# Altium schematic sheet STM32.SchDoc
size A3; SheetNumber: 2; SheetTotal: 3
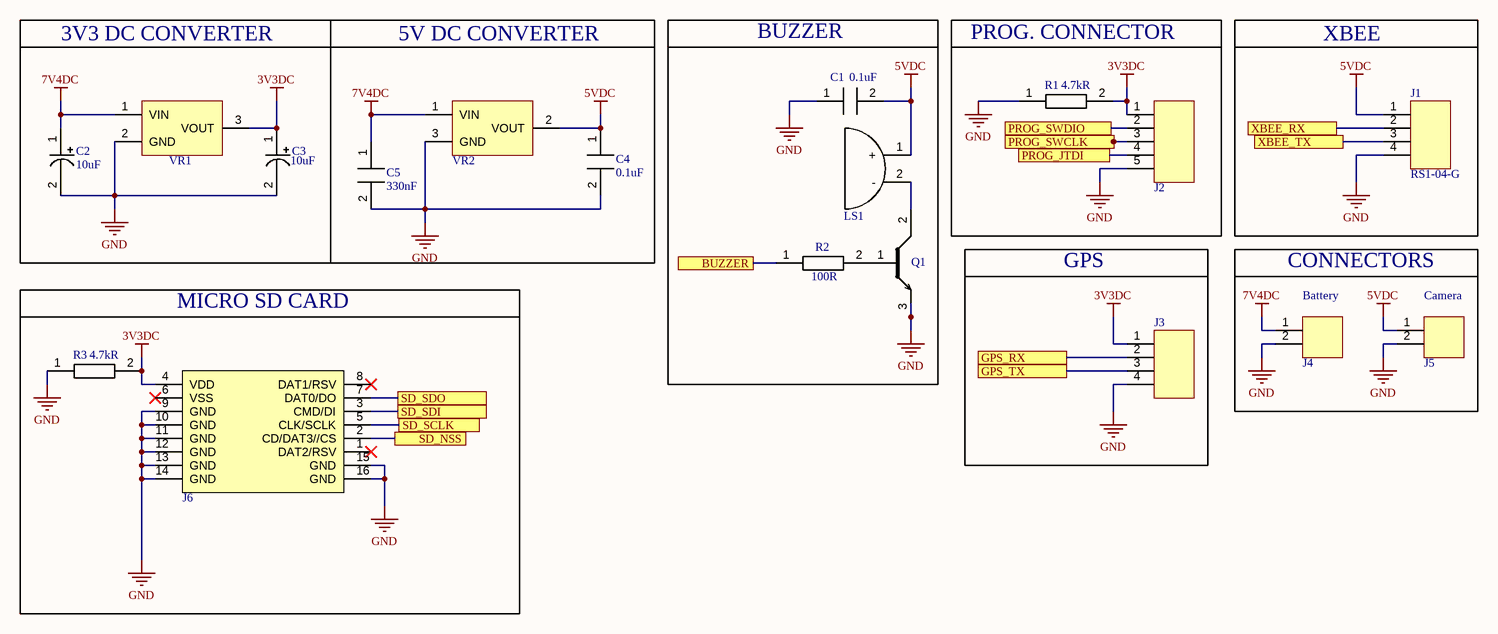
[diagram p0: STM32.SchDoc]

## Parts
C1  value 0.1uF  [CAP_1206]  (hidden comment: C1206C104K3RAC7800)
C2  value 10uF  [CAP_1206_TANT]  (hidden comment: T494A106M020AT)
C3  value 10uF  [CAP_1206_TANT]  (hidden comment: T494A106M020AT)
C4  value 0.1uF  [CAP_1206]  (hidden comment: C1206C104K3RAC7800)
C5  value 330nF  [CAP_1206]  (hidden comment: C1206C104K3RAC7800)
J1  RS1-04-G  [PINHEADER_1X4_TH]
J2  SMH-105-02-L-S  [PINHEADER1X5_RA]  (value not drawn)
J3  RS1-04-G  [PINHEADER_1X4_TH]  (value not drawn)
J4  0393570002  [2P_FEMALE_3.5MM_CONN]  (value not drawn)
J5  0393570002  [2P_FEMALE_3.5MM_CONN]  (value not drawn)
J6  2201778-1  [MICRO_SD]  (value not drawn)
LS1  CMI-9605-0580T  [CMI-9605]  (value not drawn)
Q1  MMBT3904-7-F  [SOT_23_3]  (value not drawn)
R1  value 4.7kR  [RE_1206]  (hidden comment: RC1206FR-074K7L)
R2  value 100R  [RE_0603]  (hidden comment: RC0603JR-07100RL)
R3  value 4.7kR  [RE_1206]  (hidden comment: RC1206FR-074K7L)
VR1  LD1117V33  [DPAK_TO-252-3]  (value not drawn)
VR2  L7805CDT-TR  [DPAK_TO-252-3]  (value not drawn)

## Blocks framed on the sheet
3V3 DC CONVERTER: C2 C3 VR1
BUZZER: C1 LS1 Q1 R2
PROG. CONNECTOR: J2 R1
XBEE: J1
CONNECTORS: J4 J5
GPS: J3

## Ports
BUZZER (see MCUs_STM32[4B]), GPS_RX (see MCUs_STM32[6B]), GPS_TX (see MCUs_STM32[6B]), PROG_JTDI (see MCUs_STM32[6B]), PROG_SWCLK (see MCUs_STM32[6B]), PROG_SWDIO (see MCUs_STM32[6B]), SD_NSS (see MCUs_STM32[4B]), SD_SCLK (see MCUs_STM32[4B]), SD_SDI (see MCUs_STM32[4C]), SD_SDO (see MCUs_STM32[4C]), XBEE_RX (see MCUs_STM32[6B]), XBEE_TX (see MCUs_STM32[6B])

## Nets
3V3DC: C3.1 J2.1 J3.1 J6.4(VDD) R1.2 R3.2 VR1.3(VOUT)
5VDC: C1.2 C4.1 J1.1 J5.1 LS1.1(+) VR2.2(VOUT)
7V4DC: C2.1 C5.1 J4.1 VR1.1(VIN) VR2.1(VIN)
GND: C1.1 C2.2 C3.2 C4.2 C5.2 J1.4 J2.5 J3.4 J4.2 J5.2 J6.9(GND) J6.10(GND) J6.11(GND) J6.12(GND) J6.13(GND) J6.14(GND) J6.15(GND) J6.16(GND) Q1.3 R1.1 R3.1 VR1.2(GND) VR2.3(GND)
BUZZER: R2.1 ; port BUZZER
GPS_RX: J3.2 ; port GPS_RX
GPS_TX: J3.3 ; port GPS_TX
PROG_JTDI: J2.4 ; port PROG_JTDI
PROG_SWCLK: J2.3 ; port PROG_SWCLK
PROG_SWDIO: J2.2 ; port PROG_SWDIO
SD_NSS: J6.2(CD/DAT3//CS) ; port SD_NSS
SD_SCLK: J6.5(CLK/SCLK) ; port SD_SCLK
SD_SDI: J6.3(CMD/DI) ; port SD_SDI
SD_SDO: J6.7(DAT0/DO) ; port SD_SDO
XBEE_RX: J1.2 ; port XBEE_RX
XBEE_TX: J1.3 ; port XBEE_TX
NetLS1_2: LS1.2(-) Q1.2
NetQ1_1: Q1.1 R2.2

Not connected (* = marked no-connect by the designer): J6 1(DAT2/RSV)* 6(VSS)* 8(DAT1/RSV)*

## Notes on the sheet
- 5V DC CONVERTER
- MICRO SD CARD
- (near J4) Battery
- (near J5) Camera
- Document Name
- Prepared By
- Company Name
- Checked By
- A. Can KARACAN
- Release Date
- Department
- R&D- Hardware
- Size
- Change Date
- A3
- Approved By
- Sheet
- /

## Library data of the parts
C1 C4 = CAP CER 0.1uF 1206: Multilayer Ceramic Capacitor, 0.1 uF, 25 V, ± 10%, X7R, 1206 [3216 Metric]; Manufacturer: KEMET; Manufacturer Part Number: C1206C104K3RACTU; Material: 4241ConductorMaterial; Voltage Rating: 25V; Dissipation Factor: 3.5%; Designed By: Ahmet Can; Supplier: Digi-Key; Supplier Part Number: 399-C1206C104K3RAC7800CT-ND; RoHS: Yes; Category: Ceramic Capacitors; Stock: 306395; Pricing: 1=0,1, 10=0,072, 50=0,0408, 100=0,0338, 500=0,02372, 1000=0,01963 (USD); Mounting Technology: Surface Mount; Case/Package: 1206; Case Code (Metric): 3216; Case Code (Imperial): 1206; Dielectric Material: Ceramic; Min Operating Temperature: -55°C; Max Operating Temperature: 125°C; Tolerance: 10%; Dielectric: X7R; Packaging: Cut Tape; Package Quantity: 4000; Voltage Rating (DC): 25V; Termination: SMD/SMT; Series: C; Construction: Flat; Length: 3.2mm; Width: 0.063inch; Height: 0.78mm; Depth: 1.6mm; Thickness: 0.035inch; Reach SVHC Compliant: No; RoHS Compliant: Yes; ComponentLink1URL: https://datasheet.ciiva.com/5416/kem-c1002-x7r-smd-5416282.pdf?src-supplier=Mouser; ComponentLink1Description: https://datasheet.ciiva.com/5416/kem-c1002-x7r-smd-5416282.pdf?src-supplier=Mouser
C2 C3 = CAP TAN 10uF 2306: Cap Tant Solid 10uF 20V A CASE 20% (3.2 X 1.6 X 1.6mm) SMD 3216-18 3 Ohm 125 C T/R; Manufacturer: KEMET; Supplier: Digi-Key; Supplier Part Number: 399-5157-1-ND; Manufacturer Part Number: T494A106M020AT; RoHS: Yes; Category: Tantalum Capacitors; Stock: 64164; Pricing: 1=0,78, 10=0,596, 50=0,495, 100=0,4262, 500=0,32996, 1000=0,28414 (USD); ComponentLink1URL: https://datasheet.ciiva.com/22691/1778347-22691442.pdf?src-supplier=Element14; ComponentLink1Description: https://datasheet.ciiva.com/22691/1778347-22691442.pdf?src-supplier=Element14; ComponentLink2URL: https://datasheet.ciiva.com/258/kem-t2008-t494-258774.pdf?src-supplier=Digi-Key; ComponentLink2Description: https://datasheet.ciiva.com/258/kem-t2008-t494-258774.pdf?src-supplier=Digi-Key; ComponentLink3URL: https://datasheet.ciiva.com/258/kem-t2008-t494-258775.pdf?src-supplier=Digi-Key; ComponentLink3Description: https://datasheet.ciiva.com/258/kem-t2008-t494-258775.pdf?src-supplier=Digi-Key; ComponentLink4URL: https://datasheet.ciiva.com/258/kem-t2008-t494-258776.pdf?src-supplier=Digi-Key; ComponentLink4Description: https://datasheet.ciiva.com/258/kem-t2008-t494-258776.pdf?src-supplier=Digi-Key
C5 = CAP CER 330nF 1206: Cap Ceramic 0.33uF 16V X7R 10% SMD 1206 125°C Plastic T/R; Manufacturer: KEMET; Manufacturer Part Number: C1206C334K4RAC7800; Designed By: Ahmet Can; Supplier: Digi-Key; Supplier Part Number: 399-C1206C334K4RAC7800CT-ND; RoHS: Yes; Category: Ceramic Capacitors; Stock: 6810; Pricing: 1=0,21, 10=0,144, 50=0,096, 100=0,0816, 500=0,0576, 1000=0,0504 (USD); Mounting Technology: Surface Mount; Case/Package: 1206; Dielectric Material: Ceramic; Min Operating Temperature: -55°C; Max Operating Temperature: 125°C; Tolerance: 10%; Dielectric: X7R; Packaging: Tape and Reel; Voltage Rating (DC): 16V; Construction: Flat; Length: 3.2mm; Height: 0.78mm; Depth: 1.6mm; Radiation Hardening: No; RoHS Compliant: Yes; ComponentLink1URL: http://www.kemet.com/kemet/web/homepage/kechome.nsf/weben/C4DA2DA1D1C9D3C3CA2570A50016092D/$file/KEM_C1002_X7R_SMD.pdf; ComponentLink1Description: http://www.kemet.com/kemet/web/homepage/kechome.nsf/weben/C4DA2DA1D1C9D3C3CA2570A50016092D/$file/KEM_C1002_X7R_SMD.pdf
J1 J3 = J_RS1-04-G: 4 Position Receptacle Connector 0.100" (2.54mm) Through Hole Gold; Manufacturer: Adam Equipment; Supplier: Digi-Key; Supplier Part Number: 2057-RS1-04-G-ND; Manufacturer Part Number: RS1-04-G; RoHS: No; Category: Headers and Wire Housings; Stock: 4500; Pricing: 1=0,31, 10=0,267, 80=0,20788, 800=0,15695, 1600=0,14084, 5600=0,12726, 10400=0,11878 (USD); ComponentLink1URL: https://datasheet.ciiva.com/19462/2169758-19462353.pdf?src-supplier=Jameco; ComponentLink1Description: https://datasheet.ciiva.com/19462/2169758-19462353.pdf?src-supplier=Jameco
J2 = J_SMH-105-02-L-S: 5 Position Receptacle Connector 0.100" (2.54mm) Surface Mount, Right Angle Gold; Manufacturer: Samtec; Number of Contacts: 5; Designed By: Ahmet Can; Supplier: Digi-Key; Supplier Part Number: SAM11813-ND; Manufacturer Part Number: SMH-105-02-L-S; RoHS: Yes; Category: Connectors; Stock: 47; Pricing: 1=2,18, 10=1,899, 100=1,6968, 500=1,414, 1000=1,212, 5000=1,07464 (USD); Contact Plating: Gold; Contact Material: Bronze; Contact Finish - Mating: GOLD; Insulation Color: Black; Insulation Material: Polymer; Contact Shape: Square; Min Operating Temperature: -55°C; Max Operating Temperature: 125°C; Packaging: Rail/Tube; Number of Rows: 1; Termination: Solder; Gender: Receptacle; Orientation: Horizontal; Connector Type: Receptacle; Fastening Type: Pull; Series: SMH; Contact Type: Forked; Number of Positions: 5; Pitch: 2.54mm; Radiation Hardening: No; RoHS Compliant: Yes; Reach SVHC Compliant: No; Flammability Rating: UL94 V-0; ComponentLink1URL: http://www.farnell.com/datasheets/1927708.pdf?_ga=2.237598468.569325269.1503285096-1413671594.1503025027&src-supplier=Farnell; ComponentLink1Description: http://www.farnell.com/datasheets/1927708.pdf?_ga=2.237598468.569325269.1503285096-1413671594.1503025027&src-supplier=Farnell; ComponentLink2URL: http://www.samtec.com/documents/webfiles/pdf/SMH.PDF?src-supplier=Newark; ComponentLink2Description: http://www.samtec.com/documents/webfiles/pdf/SMH.PDF?src-supplier=Newark; ComponentLink3URL: http://www.samtec.com/documents/webfiles/pdf/SMH.PDF?src-supplier=Avnet; ComponentLink3Description: http://www.samtec.com/documents/webfiles/pdf/SMH.PDF?src-supplier=Avnet; ComponentLink4URL: http://suddendocs.samtec.com/catalog_english/smh.pdf?src-supplier=Digi-Key; ComponentLink4Description: http://suddendocs.samtec.com/catalog_english/smh.pdf?src-supplier=Digi-Key
J4 J5 = J_2P_FML_3.5MM: 3.50mm Pitch Beau Eurostyle Fixed Mount PCB Terminal Block, 2 Circuits; Manufacturer: Molex; Supplier: Digi-Key; Supplier Part Number: WM7877-ND; Manufacturer Part Number: 0393570002; RoHS: Yes; Stock: 107955; Pricing: 1=1,04, 10=0,729, 25=0,6804, 50=0,6174, 100=0,6147, 250=0,51908, 500=0,49176, 1000=0,43713, 5000=0,35517 (USD); ComponentLink1URL: https://datasheet.ciiva.com/6751/393590004-sd-6751377.pdf?src-supplier=Digi-Key; ComponentLink1Description: https://datasheet.ciiva.com/6751/393590004-sd-6751377.pdf?src-supplier=Digi-Key
J6 = J_2201778-1: Conn Memory Card RCP 8 POS 1.1mm Solder RA SMD 0.5A/Contact T/R; Manufacturer: TE Connectivity; Underplate Material: Nickel; Number of Positions: 8; Shielding: Unshielded; Contact Current Rating: 500mA; Circuit Application: Signal; Pitch: 0.04inch; Designed By: Ahmet Can; Supplier: Digi-Key; Supplier Part Number: A118117CT-ND; Manufacturer Part Number: 2201778-1; RoHS: Yes; Category: Memory Connectors; Stock: 6669; Pricing: 1=2,81, 10=2,503, 25=2,49, 50=2,4646, 100=2,2614, 250=2,24864, 500=2,04538 (USD); Mounting Technology: Surface Mount; Contact Material: Copper Alloy; Contact Plating: Gold; Housing Color: Black; Color: Black; Housing Material: Polymer; Shell Material: Copper Alloy; Min Operating Temperature: -30°C; Max Operating Temperature: 85°C; Packaging: Tape and Reel; Number of Rows: 1; Series: -; Termination: SMD/SMT; Flammability Rating: UL94 V-0; RoHS Compliant: Yes; Lead Free: Lead Free; ELV: Compliant; Reach SVHC Compliant: Unknown; ComponentLink1URL: https://datasheet.ciiva.com/23834/1737844-23834387.pdf?src-supplier=Newark; ComponentLink1Description: https://datasheet.ciiva.com/23834/1737844-23834387.pdf?src-supplier=Newark; ComponentLink2URL: https://datasheet.ciiva.com/22783/600547-22783409.pdf?src-supplier=Farnell; ComponentLink2Description: https://datasheet.ciiva.com/22783/600547-22783409.pdf?src-supplier=Farnell; ComponentLink3URL: https://datasheet.ciiva.com/22796/1651579-22796241.pdf?src-supplier=Farnell; ComponentLink3Description: https://datasheet.ciiva.com/22796/1651579-22796241.pdf?src-supplier=Farnell; ComponentLink4URL: https://datasheet.ciiva.com/29722/eng-cd-2201778-a-29722873.pdf?src-supplier=Digi-Key; ComponentLink4Description: https://datasheet.ciiva.com/29722/eng-cd-2201778-a-29722873.pdf?src-supplier=Digi-Key; ComponentLink5URL: https://datasheet.ciiva.com/22710/600547-22710877.pdf?src-supplier=Element14; ComponentLink5Description: https://datasheet.ciiva.com/22710/600547-22710877.pdf?src-supplier=Element14; ComponentLink6URL: https://datasheet.ciiva.com/22726/600547-22726299.pdf?src-supplier=Element14; ComponentLink6Description: https://datasheet.ciiva.com/22726/600547-22726299.pdf?src-supplier=Element14; ComponentLink7URL: https://datasheet.ciiva.com/29722/eng-cd-2201778-a-29722874.pdf?src-supplier=Digi-Key; ComponentLink7Description: https://datasheet.ciiva.com/29722/eng-cd-2201778-a-29722874.pdf?src-supplier=Digi-Key
LS1 = LS_CMI-9605-0580T: 9.6 mm, 5 Vdc, 80 dB, Through Hole, Driving Circuit, Magnetic Audio Indicator Buzzer; Manufacturer: CUI; Designed By: Ahmet Can; Min Supply Voltage: 3V; Max Supply Voltage: 7V; SPL: 80dB @ 5V, 10cm; Nominal Supply Voltage: 5V; Frequency: 2.7kHz; Supply Current: 30mA; Supplier: Digi-Key; Supplier Part Number: 102-CMI-9605-0580T-ND; Manufacturer Part Number: CMI-9605-0580T; RoHS: No; Max Operating Temperature: 70°C; Min Operating Temperature: -30°C; Mounting Technology: Through Hole; Packaging: Box; Case/Package: CMI-9605; Voltage Rating: 5V
Q1 = Q_MMBT3904-7-F: Transistor General Purpose BJT NPN 40 Volt 0.2A Automotive 3-Pin SOT-23-3; Manufacturer: Diodes Zetex; Max Power Dissipation: 300mW; Collector Emitter Voltage (VCEO): 40V; Max Collector Current: 200mA; Collector Base Voltage (VCBO): 60V; Power Dissipation: 350mW; Frequency: 300MHz; hFE Min: 100; Number of Elements: 1; Emitter Base Voltage (VEBO): 6V; Collector Emitter Saturation Voltage: 300mV; Designed By: Ahmet Can; Supplier: Digi-Key; Supplier Part Number: MMBT3904-FDICT-ND; Manufacturer Part Number: MMBT3904-7-F; RoHS: Yes; Category: BJTs; Stock: 5948624; Pricing: 1=0,12, 10=0,111, 100=0,0607, 500=0,03732, 1000=0,02545 (USD); Mounting Technology: Surface Mount; Case/Package: SOT-23; Pins: 3; Weight: 0.000282oz; Min Operating Temperature: -55°C; Max Operating Temperature: 150°C; Polarity: NPN; Packaging: Tape and Reel; Voltage Rating (DC): 40V; Package Quantity: 3000; Transition Frequency: 300MHz; Collector Emitter Breakdown Voltage: 40V; Max Breakdown Voltage: 40V; Continuous Collector Current: 200mA; Clock Frequency: 300MHz; Gain Bandwidth Product: 300MHz; Series: Automotive, AEC-Q101; Collector-emitter Voltage-Max: 300mV; Length: 3.05mm; Width: 1.4mm; Height: 1mm; Radiation Hardening: No; Reach SVHC Compliant: No; Lead Free: Lead Free; RoHS Compliant: Yes; ComponentLink1URL: https://datasheet.ciiva.com/11201/ds30036-11201778.pdf?src-supplier=Avnet; ComponentLink1Description: https://datasheet.ciiva.com/11201/ds30036-11201778.pdf?src-supplier=Avnet; ComponentLink2URL: https://datasheet.ciiva.com/15138/getdatasheetpartid-53265-15138780.pdf?src-supplier=Verical; ComponentLink2Description: https://datasheet.ciiva.com/15138/getdatasheetpartid-53265-15138780.pdf?src-supplier=Verical; ComponentLink3URL: https://datasheet.ciiva.com/22711/1915516-22711750.pdf?src-supplier=Element14; ComponentLink3Description: https://datasheet.ciiva.com/22711/1915516-22711750.pdf?src-supplier=Element14; ComponentLink4URL: https://datasheet.ciiva.com/11198/ds30036-11198999.pdf?src-supplier=Avnet; ComponentLink4Description: https://datasheet.ciiva.com/11198/ds30036-11198999.pdf?src-supplier=Avnet; ComponentLink5URL: https://datasheet.ciiva.com/6361/ds30036-6361256.pdf?src-supplier=Digi-Key; ComponentLink5Description: https://datasheet.ciiva.com/6361/ds30036-6361256.pdf?src-supplier=Digi-Key; ComponentLink6URL: https://datasheet.ciiva.com/6361/ds30036-6361254.pdf?src-supplier=Digi-Key; ComponentLink6Description: https://datasheet.ciiva.com/6361/ds30036-6361254.pdf?src-supplier=Digi-Key
R1 R3 = RES 4K7 1206: SMD Chip Resistor, 4.7 kOhm, ± 1%, 250 mW, 1206 [3216 Metric], Thick Film, General Purpose; Manufacturer: Yageo; Voltage Rating (DC): 200V; Temperature Coefficient: 100ppm/°C; Power Rating: 250mW; Designed By: Ahmet Can; Supplier: Digi-Key; Supplier Part Number: 311-4.70KFRCT-ND; Manufacturer Part Number: RC1206FR-074K7L; RoHS: Yes; Category: Chip SMD Resistors; Stock: 2180352; Pricing: 1=0,1, 10=0,036, 50=0,0232, 100=0,0195, 500=0,01364, 1000=0,01187 (USD); Case/Package: 1206; Pins: 2; Case Code (Imperial): 1206; Case Code (Metric): 3216; Min Operating Temperature: -55°C; Max Operating Temperature: 155°C; Tolerance: 1%; Packaging: Tape and Reel; Resistor Type: Thick Film; Voltage Rating: 200V; Series: RC02H; Resistance Tolerance: 1%; Width: 1.6mm; Lead Free: Lead Free; Reach SVHC Compliant: Unknown; RoHS Compliant: Yes
R2 = RES 100 0603: Res Thick Film 0603 100 Ohm 5% 1/10W ±100ppm/°C Molded SMD SMD Paper T/R; Manufacturer: Yageo; Voltage Rating (DC): 50V; Power Rating: 100mW; Designed By: Ahmet Can; Supplier: Digi-Key; Supplier Part Number: 311-100GRCT-ND; Manufacturer Part Number: RC0603JR-07100RL; RoHS: Yes; Category: Chip SMD Resistors; Stock: 909469; Pricing: 1=0,1, 10=0,014, 50=0,0088, 100=0,0073, 500=0,00486, 1000=0,00415 (USD); Case/Package: 0603; Pins: 2; Contact Plating: Tin,Matte; Case Code (Imperial): 0603; Case Code (Metric): 1608; Min Operating Temperature: -55°C; Max Operating Temperature: 155°C; Tolerance: 5%; Temperature Coefficient: 100ppm/°C; Resistor Type: Thick Film; Packaging: Tape and Reel; Voltage Rating: 50V; Termination: SMD/SMT; Features: Moisture Resistant; Series: RC; Max Power Dissipation: 100mW; Number of Terminations: 2; Construction: Rectangular; Resistance Tolerance: 5%; Length: 1.6mm; Width: 0.8mm; Depth: 0.8mm; Lead Free: Lead Free; Reach SVHC Compliant: Unknown; Military Standard: Not; RoHS Compliant: Yes; ComponentLink1URL: https://datasheet.ciiva.com/7746/443971-7746425.pdf?src-supplier=Element14; ComponentLink1Description: https://datasheet.ciiva.com/7746/443971-7746425.pdf?src-supplier=Element14; ComponentLink2URL: https://datasheet.ciiva.com/7746/443971-7746426.pdf?src-supplier=Element14; ComponentLink2Description: https://datasheet.ciiva.com/7746/443971-7746426.pdf?src-supplier=Element14; ComponentLink3URL: https://datasheet.ciiva.com/8883/pyu-rc0603-51-rohs-l-4-8883047.pdf?src-supplier=Avnet; ComponentLink3Description: https://datasheet.ciiva.com/8883/pyu-rc0603-51-rohs-l-4-8883047.pdf?src-supplier=Avnet; ComponentLink4URL: https://datasheet.ciiva.com/15189/getdatasheetpartid-325207-15189846.pdf?src-supplier=Verical; ComponentLink4Description: https://datasheet.ciiva.com/15189/getdatasheetpartid-325207-15189846.pdf?src-supplier=Verical
VR1 = VR_LD1086DT33TR: LDO Regulator Pos 3.3V 1.3A 3-Pin(3+Tab) TO-220AB Tube; Manufacturer: STMicroelectronics; Max Supply Voltage: 15V; Number of Outputs: 1; Max Power Dissipation: 12W; Polarity: Positive; Quiescent Current: 10mA; Accuracy: 1%; Output Type: Fixed; Dropout Voltage: 1.1V; Input Bias Current: 5mA; Power Supply Rejection Ratio (PSRR): 75dB; Designed By: Ahmet Can; Supplier: Digi-Key; Supplier Part Number: 497-1491-5-ND; Manufacturer Part Number: LD1117V33; RoHS: Yes; Category: Voltage Regulators - Linear; Stock: 1467; Pricing: 1=0,83, 25=0,6952, 100=0,5566, 500=0,44002, 2500=0,3185, 10000=0,29008 (USD); Mounting Technology: Through Hole; Case/Package: TO; Pins: 3; Min Operating Temperature: 0°C; Max Operating Temperature: 125°C; Max Output current: 1.3A; Output Voltage: 3.3V; Output Current: 1.3A; Packaging: Rail/Tube; Number of Regulators: 1; Series: -; Package Quantity: 1000; Nominal Output Voltage: 3.3V; Power Dissipation: 12W; Min Output Voltage: 3.3V; Output Voltage Accuracy: 1%; Output Configuration: Positive; Supply Current: 5mA; Length: 10.4mm; Width: 4.6mm; Height: 9.15mm; Radiation Hardening: No; RoHS Compliant: Yes; Reach SVHC Compliant: No; Lead Free: Lead Free; ComponentLink1URL: https://datasheet.ciiva.com/27055/1991854-27055801.pdf?src-supplier=Jameco; ComponentLink1Description: https://datasheet.ciiva.com/27055/1991854-27055801.pdf?src-supplier=Jameco; ComponentLink2URL: https://datasheet.ciiva.com/15110/getdatasheetpartid-31296-15110899.pdf?src-supplier=Verical; ComponentLink2Description: https://datasheet.ciiva.com/15110/getdatasheetpartid-31296-15110899.pdf?src-supplier=Verical; ComponentLink3URL: https://datasheet.ciiva.com/2044/cd00000544-2044225.pdf?src-supplier=Digi-Key; ComponentLink3Description: https://datasheet.ciiva.com/2044/cd00000544-2044225.pdf?src-supplier=Digi-Key; ComponentLink4URL: https://datasheet.ciiva.com/1511/1776449-1511579.pdf?src-supplier=Element14; ComponentLink4Description: https://datasheet.ciiva.com/1511/1776449-1511579.pdf?src-supplier=Element14; ComponentLink5URL: https://datasheet.ciiva.com/16457/cd00000544-16457726.pdf?src-supplier=Future+Electronics; ComponentLink5Description: https://datasheet.ciiva.com/16457/cd00000544-16457726.pdf?src-supplier=Future+Electronics
VR2 = VR_L7805CDT-TR: IC REG LDO 5V 1.5A DPAK; Manufacturer: STMicroelectronics; Designed By: Ahmet Can; Supplier: Digi-Key; Supplier Part Number: 497-7255-1-ND; Manufacturer Part Number: L7805CDT-TR; RoHS: Yes; Category: Voltage Regulators - Linear; Stock: 44558; Pricing: 1=1,12, 10=1, 25=0,9488, 100=0,7795, 250=0,72868, 500=0,64396, 1000=0,50839 (USD); ComponentLink1URL: https://datasheet.ciiva.com/2042/cd00000444-2042783.pdf?src-supplier=Digi-Key; ComponentLink1Description: https://datasheet.ciiva.com/2042/cd00000444-2042783.pdf?src-supplier=Digi-Key; ComponentLink2URL: https://datasheet.ciiva.com/2042/cd00000444-2042784.pdf?src-supplier=Digi-Key; ComponentLink2Description: https://datasheet.ciiva.com/2042/cd00000444-2042784.pdf?src-supplier=Digi-Key; ComponentLink3URL: https://datasheet.ciiva.com/2042/cd00000444-2042785.pdf?src-supplier=Digi-Key; ComponentLink3Description: https://datasheet.ciiva.com/2042/cd00000444-2042785.pdf?src-supplier=Digi-Key; ComponentLink4URL: https://datasheet.ciiva.com/16357/cd00000444-16357893.pdf?src-supplier=Future+Electronics; ComponentLink4Description: https://datasheet.ciiva.com/16357/cd00000444-16357893.pdf?src-supplier=Future+Electronics; ComponentLink5URL: https://datasheet.ciiva.com/4882/cd00000444-4882231.pdf?src-supplier=Mouser; ComponentLink5Description: https://datasheet.ciiva.com/4882/cd00000444-4882231.pdf?src-supplier=Mouser